# EAGLE design lt mikro workshop (EAGLE 7.6.0)
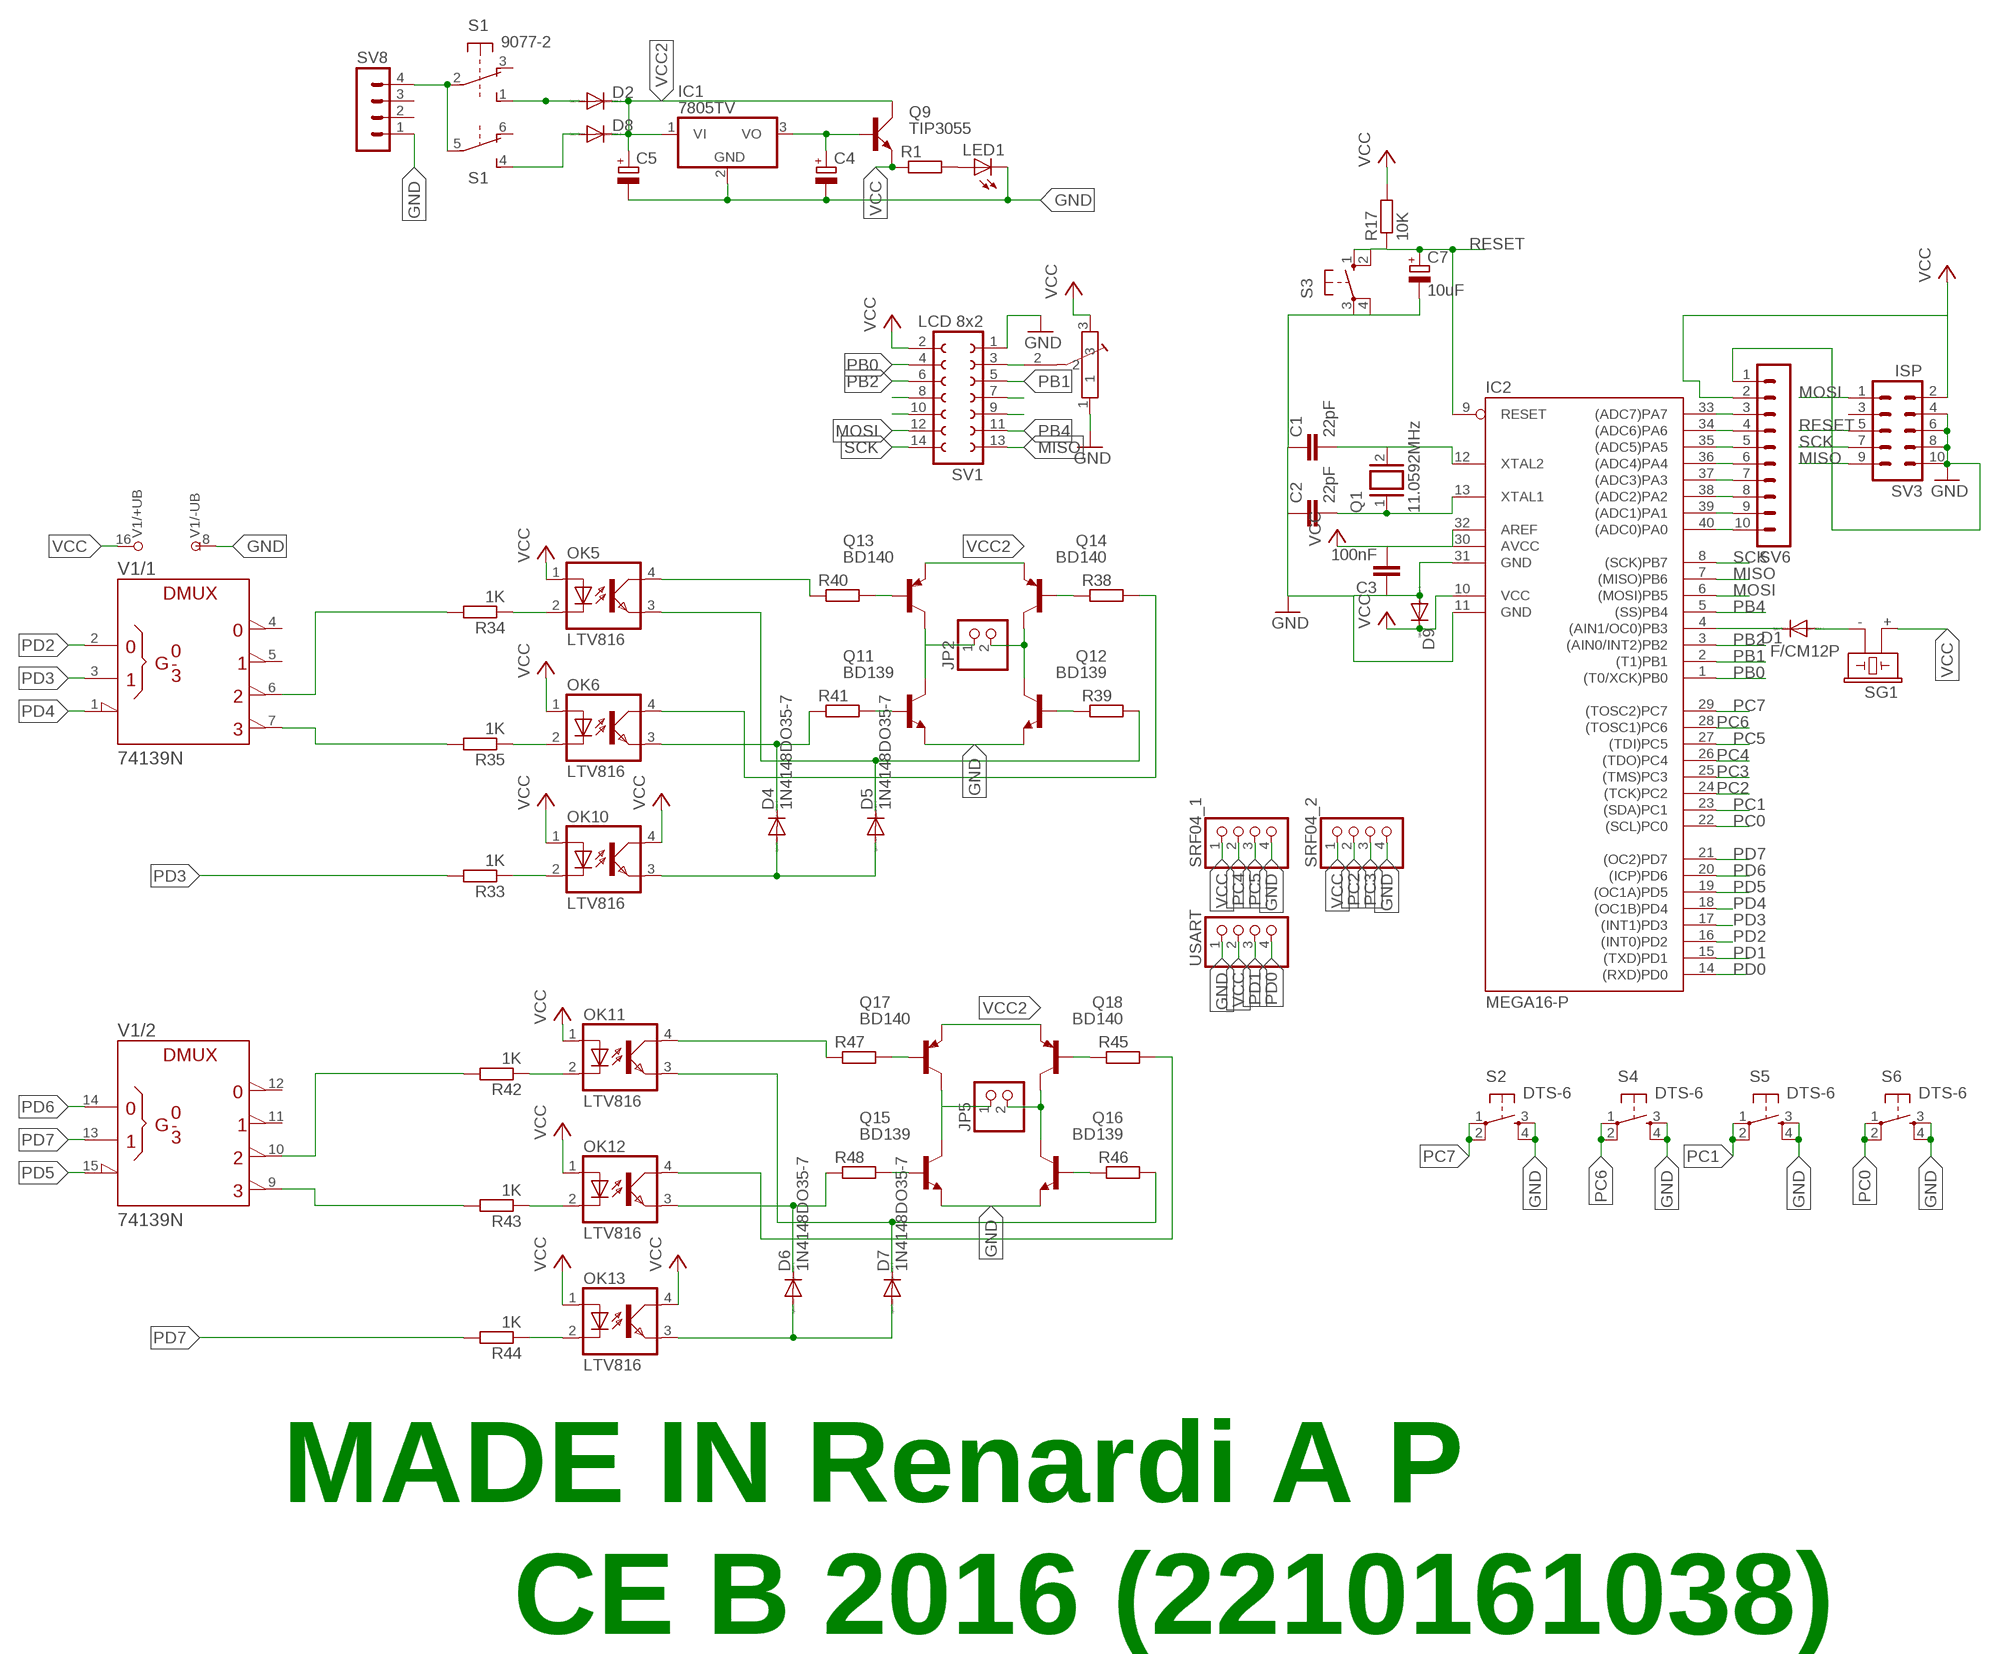
[diagram p0: schematic, sheet 1]

## Parts
C1  22pF  C2.5/2  [C2.5-2]
C2  22pF  C2.5/2  [C2.5-2]
C3  100nF  C2.5/2  [C2.5-2]
C4  CPOL-EUE3.5-10  [E3,5-10]
C5  CPOL-EUE3.5-10  [E3,5-10]
C7  10uF  CPOL-EUE2-5  [E2-5]
D1  DIODE-DO214AA  [DO214AA]
D2  DIODE-DO214AA  [DO214AA]
D4  1N4148DO35-7  [DO35-7]
D5  1N4148DO35-7  [DO35-7]
D6  1N4148DO35-7  [DO35-7]
D7  1N4148DO35-7  [DO35-7]
D8  DIODE-DO214AA  [DO214AA]
D9  DIODE-DO214AA  [DO214AA]
IC1  7805TV  [TO220V]
IC2  MEGA16-P  [DIL40]
JP2  PINHD-1X2  [1X02]
JP5  PINHD-1X2  [1X02]
LED1  LED3MM  [LED3MM]
OK5  LTV816  [DIL04]
OK6  LTV816  [DIL04]
OK10  LTV816  [DIL04]
OK11  LTV816  [DIL04]
OK12  LTV816  [DIL04]
OK13  LTV816  [DIL04]
Q1  11.0592MHz  XTAL/S  [QS]
Q9  TIP3055  [TOP3AV]
Q11  BD139  [TO126]
Q12  BD139  [TO126]
Q13  BD140  [TO126]
Q14  BD140  [TO126]
Q15  BD139  [TO126]
Q16  BD139  [TO126]
Q17  BD140  [TO126]
Q18  BD140  [TO126]
R1  R-EU_0207/7  [0207/7]
R17  10K  R-EU_0204/7  [0204/7]
R33  1K  R-EU_0204/7  [0204/7]
R34  1K  R-EU_0204/7  [0204/7]
R35  1K  R-EU_0204/7  [0204/7]
R38  R-EU_0207/7  [0207/7]
R39  R-EU_0207/7  [0207/7]
R40  R-EU_0207/7  [0207/7]
R41  R-EU_0207/7  [0207/7]
R42  1K  R-EU_0204/7  [0204/7]
R43  1K  R-EU_0204/7  [0204/7]
R44  1K  R-EU_0204/7  [0204/7]
R45  R-EU_0207/7  [0207/7]
R46  R-EU_0207/7  [0207/7]
R47  R-EU_0207/7  [0207/7]
R48  R-EU_0207/7  [0207/7]
S1  9077-2  [9077-2]
S2  DTS-6  [DTS-6]
S3  10-XX  [B3F-10XX]
S4  DTS-6  [DTS-6]
S5  DTS-6  [DTS-6]
S6  DTS-6  [DTS-6]
SG1  F/CM12P  [F/CM12P]
SRF04_1  PINHD-1X4  [1X04]
SRF04_2  PINHD-1X4  [1X04]
SV1  LCD 8x2  FE07-2  [FE07-2]
SV3  ISP  MA05-2  [MA05-2]
SV6  MA10-1  [MA10-1]
SV8  MA04-1  [MA04-1]
U$1  TRIMPOT  [TRIMPOT]
USART  PINHD-1X4  [1X04]
V1  74139N  [DIL16]

## Nets
GND: C1.1 C2.1 C3.1 C4.- C5.- C7.- D9.A IC1.2(GND) IC2.11(GND) IC2.31(GND) LED1.K(C) Q11.1(E) Q12.1(E) Q15.1(E) Q16.1(E) S2.3 S2.4 S3.3(P) S3.4(P1) S4.3 S4.4 S5.3 S5.4 S6.3 S6.4 SRF04_1.4 SRF04_2.4 SV1.1 SV3.4 SV3.6 SV3.8 SV3.10 SV6.1 SV8.1 U$1.1 USART.1 V1.8(/-UB:-UB)
MISO: IC2.7((MISO)PB6) SV1.13 SV3.9
MOSI: IC2.6((MOSI)PB5) SV1.12 SV3.1
N$2: LED1.A R1.2
N$3: D8.A S1.4(2:S)
N$4: D1.C IC2.4((AIN1/OC0)PB3)
N$5: SV1.8
N$6: SV1.10
N$7: SV1.7
N$9: C2.2 IC2.13(XTAL1) Q1.1
N$10: C1.2 IC2.12(XTAL2) Q1.2
N$11: D2.A S1.1(1:S)
N$14: OK10.2(C) R33.1
N$17: OK5.2(C) R34.1
N$18: OK6.2(C) R35.1
N$19: C4.+ IC1.3(VO) Q9.B
N$21: JP2.1 Q11.2(C) Q13.2(C)
N$22: S1.2(1:P) S1.5(2:P) SV8.4
N$23: SV1.9
N$24: JP2.2 Q12.2(C) Q14.2(C)
N$25: Q13.3(B) R40.2
N$26: Q14.3(B) R38.1
N$27: Q12.3(B) R39.1
N$48: R35.2 V1.7(/1:Y3)
N$49: R34.2 V1.6(/1:Y2)
N$50: Q11.3(B) R41.2
N$52: IC2.40((ADC0)PA0) SV6.10
N$53: IC2.33((ADC7)PA7) SV6.3
N$54: IC2.34((ADC6)PA6) SV6.4
N$55: IC2.35((ADC5)PA5) SV6.5
N$56: IC2.36((ADC4)PA4) SV6.6
N$57: IC2.37((ADC3)PA3) SV6.7
N$58: D1.A SG1.-
N$59: OK5.4(COL) R40.1
N$60: IC2.38((ADC2)PA2) SV6.8
N$61: IC2.39((ADC1)PA1) SV6.9
N$62: D5.C OK5.3(EMIT) R39.2
N$63: OK6.4(COL) R38.2
N$64: D4.C OK6.3(EMIT) R41.1
N$65: D4.A D5.A OK10.3(EMIT)
N$66: OK12.2(C) R43.1
N$67: OK11.2(C) R42.1
N$68: OK13.2(C) R44.1
N$70: R43.2 V1.9(/2:Y3)
N$71: R42.2 V1.10(/2:Y2)
N$72: JP5.1 Q15.2(C) Q17.2(C)
N$73: JP5.2 Q16.2(C) Q18.2(C)
N$74: Q17.3(B) R47.2
N$75: Q18.3(B) R45.1
N$76: Q16.3(B) R46.1
N$77: Q15.3(B) R48.2
N$78: OK11.4(COL) R47.1
N$79: D7.C OK11.3(EMIT) R46.2
N$80: OK12.4(COL) R45.2
N$81: D6.C OK12.3(EMIT) R48.1
N$82: D6.A D7.A OK13.3(EMIT)
PB0: IC2.1((T0/XCK)PB0) SV1.3 SV1.4 U$1.2
PB1: IC2.2((T1)PB1) SV1.5
PB2: IC2.3((AIN0/INT2)PB2) SV1.6
PB4: IC2.5((SS)PB4) SV1.11
PC0: IC2.22((SCL)PC0) S6.1 S6.2
PC1: IC2.23((SDA)PC1) S5.1 S5.2
PC2: IC2.24((TCK)PC2) SRF04_2.2
PC3: IC2.25((TMS)PC3) SRF04_2.3
PC4: IC2.26((TDO)PC4) SRF04_1.2
PC5: IC2.27((TDI)PC5) SRF04_1.3
PC6: IC2.28((TOSC1)PC6) S4.1 S4.2
PC7: IC2.29((TOSC2)PC7) S2.1 S2.2
PD0: IC2.14((RXD)PD0) USART.4
PD1: IC2.15((TXD)PD1) USART.3
PD2: IC2.16((INT0)PD2) V1.2(/1:A)
PD3: IC2.17((INT1)PD3) R33.2 V1.3(/1:B)
PD4: IC2.18((OC1B)PD4) V1.1(/1:!G)
PD5: IC2.19((OC1A)PD5) V1.15(/2:!G)
PD6: IC2.20((ICP)PD6) V1.14(/2:A)
PD7: IC2.21((OC2)PD7) R44.2 V1.13(/2:B)
RESET: C7.+ IC2.9(RESET) R17.1 S3.1(S) S3.2(S1) SV3.5
SCK: IC2.8((SCK)PB7) SV1.14 SV3.7
VCC: C3.2 D9.C IC2.10(VCC) IC2.30(AVCC) IC2.32(AREF) OK5.1(A) OK6.1(A) OK10.1(A) OK10.4(COL) OK11.1(A) OK12.1(A) OK13.1(A) OK13.4(COL) Q9.E R1.1 R17.2 SG1.+ SRF04_1.1 SRF04_2.1 SV1.2 SV3.2 SV6.2 U$1.3 USART.2 V1.16(/+UB:+UB)
VCC2: C5.+ D2.C D8.C IC1.1(VI) Q9.C Q13.1(E) Q14.1(E) Q17.1(E) Q18.1(E)
Unconnected: S1.3(1:O) S1.6(2:O) SV3.3 SV8.2 SV8.3 V1.4(/1:Y0) V1.5(/1:Y1) V1.11(/2:Y1) V1.12(/2:Y0)

## Notes on the sheet
- MADE IN Renardi A P
- CE B 2016 (2210161038)

## Library data of the parts
C1-C3 = capacitor-wima:C: CAPACITOR naming: grid - package width
C4 C5 C7 = rcl:CPOL-EU: POLARIZED CAPACITOR, European symbol
D1 D2 D8 D9 = diode:DIODE-: DIODE
D4-D7 = diode:1N4148: DIODE high speed (Philips)
IC1 = linear:78*: Positive VOLTAGE REGULATOR Source: http://cache.national.com/ds/LM/LM78L05.pdf http://www.fairchildsemi.com/ds/LM/LM7805.pdf
IC2 = atmel:MEGA16-P: MICROCONTROLLER 16 Kbytes FLASH 1 kbytes SRAM 512 bytes EEPROM USART 8-channel 10 bit ADC Source: avr.lbr
JP2 JP5 = pinhead:PINHD-1X2: PIN HEADER
LED1 = led:LED: LED OSRAM: - CHIPLED LG R971, LG N971, LY N971, LG Q971, LY Q971, LO R971, LY R971 LH N974, LH R974 LS Q976, LO Q976, LY Q976 LO Q996 - Hyper CHIPLED LW Q18S LB Q993, LB Q99A, LB R99A - SideLED LS A670, LO A670, LY A670, LG A670, LP A670 LB A673, LV A673, LT A673, LW A673 LH A674 LY A675 LS A676, LA A676, LO A676, LY A676, LW A676 LS A679, LY A679, LG A679 - Hyper Micro SIDELED® LS Y876, LA Y876, LO Y876, LY Y876 LT Y87S - SmartLED LW L88C, LW L88S LB L89C, LB L89S, LG L890 LS L89K, LO L89K, LY L89K LS L896, LA L896, LO L896, LY L896 - TOPLED LS T670, LO T670, LY T670, LG T670, LP T670 LSG T670, LSP T670, LSY T670, LOP T670, LYG T670 LG T671, LOG T671, LSG T671 LB T673, LV T673, LT T673, LW T673 LH T674 LS T676, LA T676, LO T676, LY T676, LB T676, LH T676, LSB T676, LW T676 LB T67C, LV T67C, LT T67C, LS T67K, LO T67K, LY T67K, LW E67C LS E67B, LA E67B, LO E67B, LY E67B, LB E67C, LV E67C, LT E67C LW T67C LS T679, LY T679, LG T679 LS T770, LO T770, LY T770, LG T770, LP T770 LB T773, LV T773, LT T773, LW T773 LH T774 LS E675, LA E675, LY E675, LS T675 LS T776, LA T776, LO T776, LY T776, LB T776 LHGB T686 LT T68C, LB T68C - Hyper Mini TOPLED® LB M676 - Mini TOPLED Santana® LG M470 LS M47K, LO M47K, LY M47K Source: http://www.osram.convergy.de LUXEON: - LUMILED® LXK2-PW12-R00, LXK2-PW12-S00, LXK2-PW14-U00, LXK2-PW14-V00 LXK2-PM12-R00, LXK2-PM12-S00, LXK2-PM14-U00 LXK2-PE12-Q00, LXK2-PE12-R00, LXK2-PE12-S00, LXK2-PE14-T00, LXK2-PE14-U00 LXK2-PB12-K00, LXK2-PB12-L00, LXK2-PB12-M00, LXK2-PB14-N00, LXK2-PB14-P00, LXK2-PB14-Q00 LXK2-PR12-L00, LXK2-PR12-M00, LXK2-PR14-Q00, LXK2-PR14-R00 LXK2-PD12-Q00, LXK2-PD12-R00, LXK2-PD12-S00 LXK2-PH12-R00, LXK2-PH12-S00 LXK2-PL12-P00, LXK2-PL12-Q00, LXK2-PL12-R00 Source: www.luxeon.com KINGBRIGHT: KA-3528ASYC Source: www.kingbright.com
OK5 OK6 OK10-OK13 = optocoupler:LTV816: OPTO COUPLER Source: LITEON, LTV816.pdf
Q1 = special:XTAL/S: CRYSTAL
Q9 = transistor-power:TIP3055: NPN TRANSISTOR
Q11 Q12 Q15 Q16 = transistor-npn:BD139*: NPN Transistor
Q13 Q14 Q17 Q18 = transistor-pnp:BD140: PNP Transistor
R1 R17 R33-R35 R38-R48 = resistor:R-EU_: RESISTOR, European symbol
S1 = switch-misc:9077-2: MARQUARDT SWITCH 9077.0200 Distributor: Buerklin <https://www.buerklin.com/default.asp?event=ShowArtikel%2812G2822%29&l=d&jump=ArtNr_12G2822>
S2 S4-S6 = switch-tact:DTS-6
S3 = switch-omron:10-XX: OMRON SWITCH
SG1 = buzzer:F/CM12P: BUZZER Source: Buerklin
SRF04_1 SRF04_2 USART = pinhead:PINHD-1X4: PIN HEADER
SV1 = con-lsta:FE07-2: FEMALE HEADER
SV3 = con-lstb:MA05-2: PIN HEADER
SV6 = con-lstb:MA10-1: PIN HEADER
SV8 = con-lstb:MA04-1: PIN HEADER; OC_FARNELL: unknown; OC_NEWARK: unknown
U$1 = trimpot:TRIMPOT
V1 = 74ttl-din:74*139: Dual 2-line to 4-line DECODER/DEMULTIPLEXER

## Board
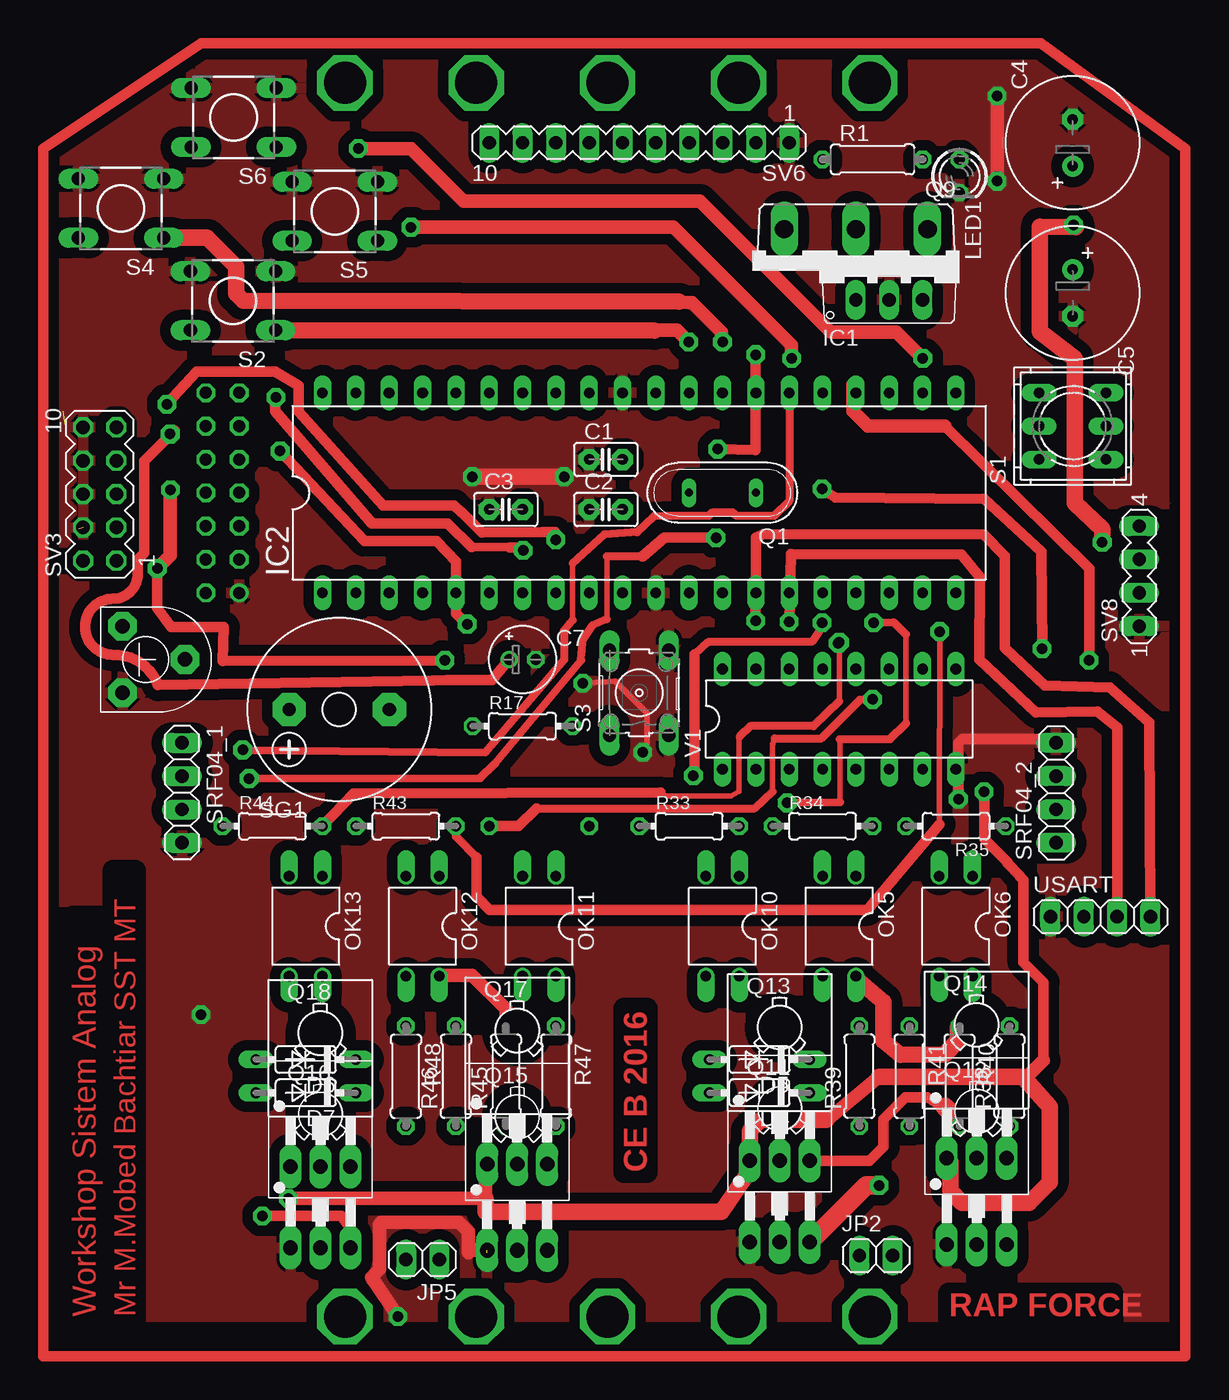
[diagram p1: board, top side]
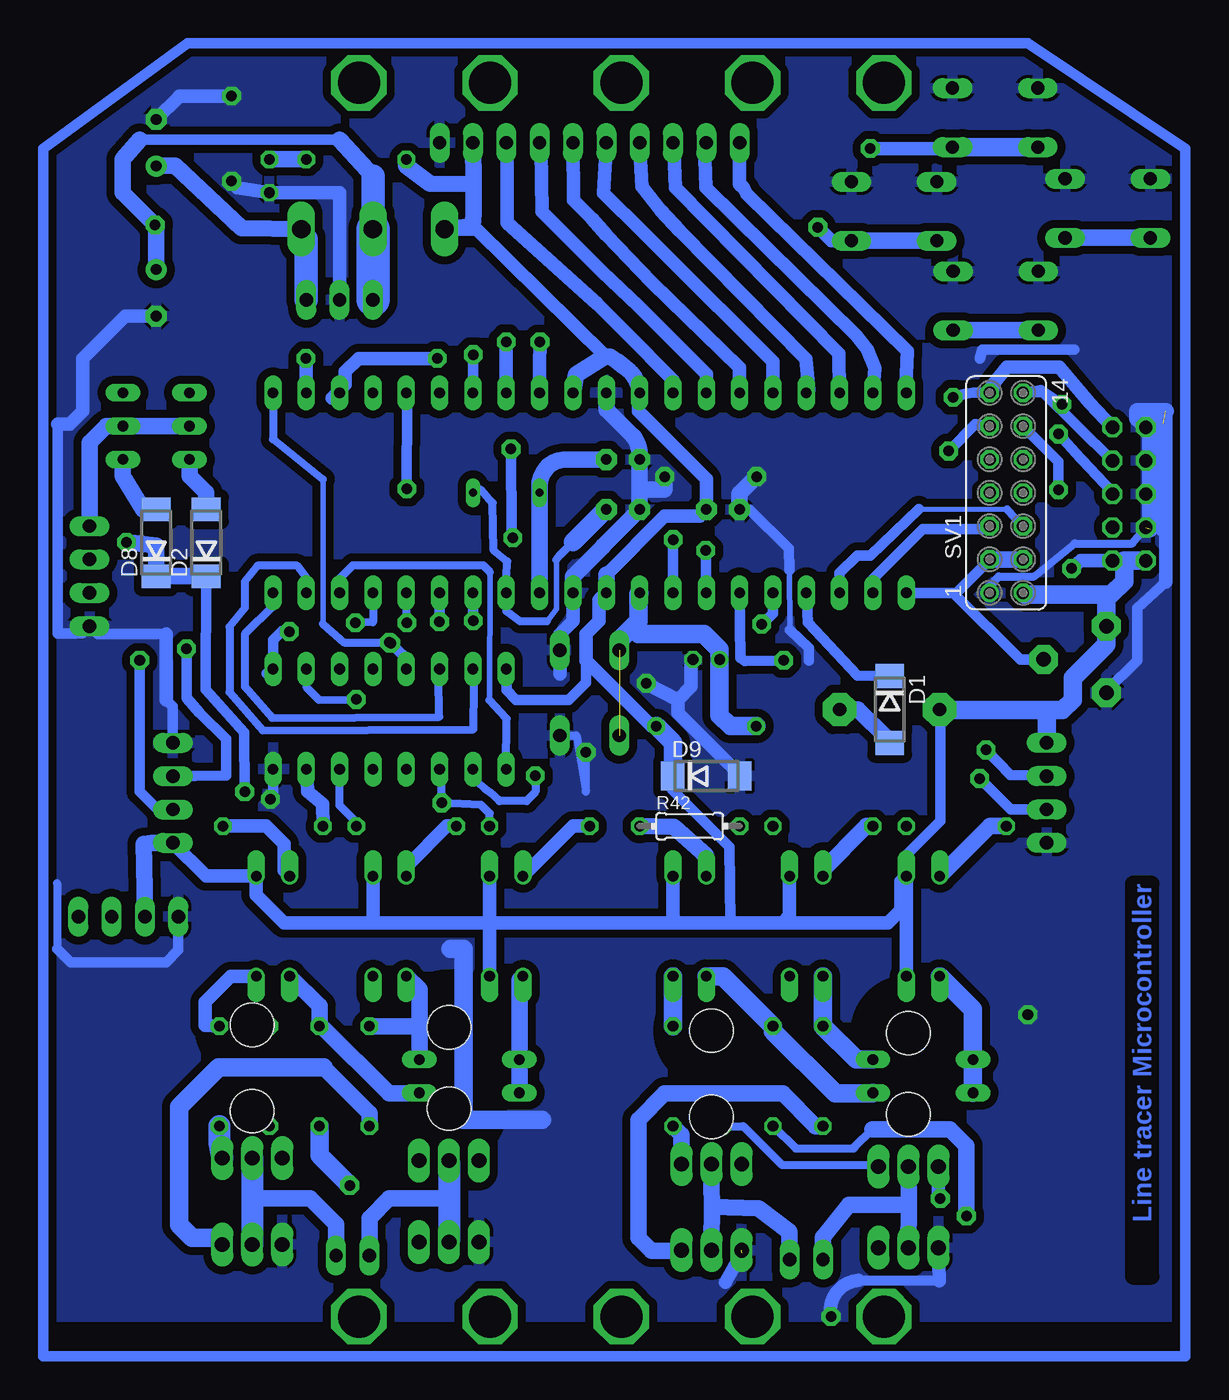
[diagram p2: board, bottom side, seen from below]

No outline drawn. Coordinates in mm, seen from the top.
Copper layers (1*16): Top 0.035mm / dielectric 1.5mm / Bottom 0.035mm
Design rules "default": minimum track width 10mil, minimum drill 24mil, track to track 8mil, track to pad 8mil, pad to pad 8mil, via to via 8mil, smd to smd 8mil, copper to edge 40mil, drill to drill 8mil, minimum pad ring 10mil, minimum via ring 8mil, stop-mask expansion 4mil, vias tented up to drill 0mil, thermal gap 10mil

### Footprints (pad centres in the part's own frame; a part is rotated, then mirrored left to right if it is on the bottom)
C2.5-2 = drill 0.813 pad 1.6 octagon: 1 -1.27,0; 2 1.27,0
E3,5-10 = drill 0.813 pad 1.6: + -1.778,0 | drill 0.813 pad 1.6 octagon: - 1.778,0
E2-5 = drill 0.813 pad 1.27: + -1.016,0 | drill 0.813 pad 1.27 octagon: - 1.016,0
DO214AA = smd 1.8 x 2.2: A 2.55,0; C -2.55,0
DO35-7 = drill 0.813 long: A 3.81,0; C -3.81,0
TO220V = drill 1.016 long: 1 -2.54,-2.54; 2 0,-2.54; 3 2.54,-2.54
DIL40 = drill 0.813 long: 1 -24.13,-7.62; 2 -21.59,-7.62; 3 -19.05,-7.62; 4 -16.51,-7.62; 5 -13.97,-7.62; 6 -11.43,-7.62; 7 -8.89,-7.62; 8 -6.35,-7.62; 9 -3.81,-7.62; 10 -1.27,-7.62; 11 1.27,-7.62; 12 3.81,-7.62; 13 6.35,-7.62; 14 8.89,-7.62; 15 11.43,-7.62; 16 13.97,-7.62; 17 16.51,-7.62; 18 19.05,-7.62; 19 21.59,-7.62; 20 24.13,-7.62; 21 24.13,7.62; 22 21.59,7.62; 23 19.05,7.62; 24 16.51,7.62; 25 13.97,7.62; 26 11.43,7.62; 27 8.89,7.62; 28 6.35,7.62; 29 3.81,7.62; 30 1.27,7.62; 31 -1.27,7.62; 32 -3.81,7.62; 33 -6.35,7.62; 34 -8.89,7.62; 35 -11.43,7.62; 36 -13.97,7.62; 37 -16.51,7.62; 38 -19.05,7.62; 39 -21.59,7.62; 40 -24.13,7.62
1X02 = drill 1.016 long: 1 -1.27,0; 2 1.27,0
LED3MM = drill 0.813 octagon: A -1.27,0; K 1.27,0
DIL04 = drill 0.813 offset: 1 -1.27,-3.81; 2 1.27,-3.81; 3 1.27,3.81; 4 -1.27,3.81
QS = drill 0.61 long: 1 -2.54,0; 2 2.54,0
TOP3AV = drill 1.397 long: B -5.461,-3.175; C 0,-3.175; E 5.461,-3.175
TO126 = drill 1.118 long: 1 -2.286,-5.08; 2 0,-5.08; 3 2.286,-5.08 | hole 3.302: 0,5.08
0207/7 = drill 0.813 octagon: 1 -3.81,0; 2 3.81,0
0204/7 = drill 0.813 octagon: 1 -3.81,0; 2 3.81,0
9077-2 = drill 0.813 long: 1 -2.54,2.54; 2 0,2.54; 3 2.54,2.54; 4 -2.54,-2.54; 5 0,-2.54; 6 2.54,-2.54
DTS-6 = drill 1 long: 1 -3.25,2.25; 2 3.25,2.25; 3 -3.25,-2.25; 4 3.25,-2.25
B3F-10XX = drill 1.016 long: 1 -3.251,2.261; 2 3.251,2.261; 3 -3.251,-2.261; 4 3.251,-2.261
F/CM12P = drill 1.016 pad 2.54 octagon: + 3.81,0; - -3.81,0
1X04 = drill 1.016 long: 1 -3.81,0; 2 -1.27,0; 3 1.27,0; 4 3.81,0
FE07-2 = drill 0.914: 1 -7.62,1.27 | drill 0.914 octagon: 2 -7.62,-1.27; 3 -5.08,1.27; 4 -5.08,-1.27; 5 -2.54,1.27; 6 -2.54,-1.27; 7 0,1.27; 8 0,-1.27; 9 2.54,1.27; 10 2.54,-1.27; 11 5.08,1.27; 12 5.08,-1.27; 13 7.62,1.27; 14 7.62,-1.27
MA05-2 = drill 1.016 octagon: 1 -5.08,-1.27; 2 -5.08,1.27; 3 -2.54,-1.27; 4 -2.54,1.27; 5 0,-1.27; 6 0,1.27; 7 2.54,-1.27; 8 2.54,1.27; 9 5.08,-1.27; 10 5.08,1.27
MA10-1 = drill 1.016 long: 1 -11.43,0; 2 -8.89,0; 3 -6.35,0; 4 -3.81,0; 5 -1.27,0; 6 1.27,0; 7 3.81,0; 8 6.35,0; 9 8.89,0; 10 11.43,0
MA04-1 = drill 1.016 long: 1 -3.81,0; 2 -1.27,0; 3 1.27,0; 4 3.81,0
TRIMPOT = drill 1.1 pad 2.184 octagon: 1 -2.538,1.271; 2 0,-3.5; 3 2.536,1.271
DIL16 = drill 0.813 long: 1 -8.89,-3.81; 2 -6.35,-3.81; 3 -3.81,-3.81; 4 -1.27,-3.81; 5 1.27,-3.81; 6 3.81,-3.81; 7 6.35,-3.81; 8 8.89,-3.81; 9 8.89,3.81; 10 6.35,3.81; 11 3.81,3.81; 12 1.27,3.81; 13 -1.27,3.81; 14 -3.81,3.81; 15 -6.35,3.81; 16 -8.89,3.81

### Placement (x,y rotation side)
C1  42.85,67.31 0 top
C2  42.85,63.5 0 top
C3  35.23,63.5 0 top
C4  78.41,91.44 90 top
C5  78.41,80.01 270 top
C7  36.5,52.07 0 top
D1  22.53,48.26 270 bottom
D2  74.6,60.96 90 bottom
D4  54.55,19.05 180 top
D5  54.55,21.59 180 top
D6  19.99,21.59 180 top
D7  19.99,19.05 180 top
D8  78.41,60.96 90 bottom
D9  36.5,43.18 0 bottom
IC1  64.44,82.01 0 top
IC2  45.39,64.77 0 top
JP2  63.44,6.65 0 top
JP5  28.88,6.35 180 top
LED1  69.79,88.9 270 top
OK5  60.63,31.75 180 top
OK6  69.52,31.75 180 top
OK10  51.74,31.75 180 top
OK11  37.77,31.75 180 top
OK12  28.88,31.75 180 top
OK13  19.99,31.75 180 top
Q1  51.74,64.77 180 top
Q9  61.9,81.68 180 top
Q11  56.1,12.77 0 top
Q12  71.1,12.58 0 top
Q13  56.1,18.96 0 top
Q14  71.1,19.15 0 top
Q15  36.1,12.14 0 top
Q16  21.1,12.33 0 top
Q17  36.1,18.71 0 top
Q18  21.1,18.52 0 top
R1  63.17,90.17 0 top
R17  36.5,46.99 0 top
R33  49.2,39.37 0 top
R34  59.36,39.37 0 top
R35  69.52,39.37 180 top
R38  73.6,20.32 90 top
R39  62.17,20.32 90 top
R40  69.79,20.32 270 top
R41  65.98,20.32 270 top
R42  37.77,39.37 0 bottom
R43  27.61,39.37 0 top
R44  17.45,39.37 0 top
R45  35.23,20.32 90 top
R46  31.42,20.32 90 top
R47  39.04,20.32 270 top
R48  27.61,20.32 270 top
S1  78.41,69.85 90 top
S2  14.45,79.4 180 top
S3  45.39,49.53 90 top
S4  5.91,86.44 180 top
S5  22.19,86.22 180 top
S6  14.49,93.36 180 top
SG1  22.53,48.26 180 top
SRF04_1  10.56,41.91 270 top
SRF04_2  77.14,41.91 90 top
SV1  13.64,64.77 90 bottom
SV3  4.29,64.67 90 top
SV6  45.39,91.44 180 top
SV8  83.49,58.42 90 top
U$1  7.29,52.07 90 top
USART  80.54,32.47 0 top
V1  60.63,47.53 0 top

### Tracks (layer width: path | path; a pad name or v marks a point on that pad's centre or on a via)
GND  (via drill 0.8 pad 1.42)  (4 unrouted)
  Top 0.406: v41.08,50.25 43.56,50.44 46,48 46,45
  Top 0.813: v69.71,41.42 69.71,45.71 70,46 76.86,46 SRF04_2.4
  Top 1.016: v72.67,88.51 v72.67,95 | v27,2 25,5 25.59,5.59 25.59,9.03 25.74,9.18 31.68,9.18 32.4,8.46 32.4,6.88 32.58,7.06 Q15.1
  Top 1.27: v32.67,66 v39.67,66
  Bottom 0.406: 30.14,54.31 30.16,58.89
  Bottom 0.61: SV1.1 14.91,57.67 14.22,58.39 11.51,58.39 8.42,60.91 4.04,60.91 SV3.4 | 85.96,35.03 85.96,30.03 | S3.3 46.39,46.28 45.67,42 v45.67,45
  Bottom 0.813: U$1.1 6.02,49.65 3.67,52 3.67,56 1.47,57.96 | 8.47,75.69 15.47,75.69 15.67,75 | 28.67,52 28.67,52.93 30.14,54.31 | 30.16,58.89 30.21,60.52 33.2,63.5 C3.1 | SRF04_2.4 77.14,48.47 77.67,49 | 77.67,54 82.88,54 SV8.1 84.05,54.05 85.9,54.05 85.9,64 | USART.1 76.72,29.94 77.67,29 84.94,29 85.96,30.03 | 85.9,63.99 85.9,70 | V1.8 69.52,41.61 v69.71,41.42 | 18.74,4.74 24.9,4.75
  Bottom 1.016: IC1.2 64.44,87.63 LED1.K 72.25,88 v72.67,88.51 | IC2.11 46.67,55 47.65,54.02 S3.4 47.65,50.98 | v41.08,50.25 38.67,49 | 38.67,49 37.67,50 37.67,51.91 C7.- | D9.A 33.95,43.28 38.67,48 38.67,49 | v72.67,95 76.67,95 76.67,94.96 C4.- | 1.47,57.96 1.49,70.98 | 77.67,49 77.67,54 | 85.9,70 85,70 84,71 84,75 80.77,78.23 C5.- | 35.03,4.6 33.78,6.87 | Q16.1 18.74,4.74 | 24.9,4.75 arc-98 v27,2
  Bottom 1.27: 41.58,65 C1.1 41.58,67.75 arc-45 42.16,69.16 44.12,71.12 IC2.31 | 41.58,65 C2.1 44.37,60.71 44.37,60.68 46.66,58.39 IC2.11 | C3.1 33.96,64.71 v32.67,66 | v39.67,66 39.67,65 41.58,65 | 1.49,70.98 3.67,71 3.67,70.41 SV3.10 | 2.67,70 2.67,62 | 1.67,70 1.67,62
  Bottom 1.422: 56,30 55,30 55,17 49,17
  other vias: 12,25
  pour Bottom (isolate 0.61): 12,98 76,98 86,91 86,2 1,2 1,91
  pour Top (isolate 0.813): 12,98 76,98 86,91 86,2 1,2 1,91
MISO  (via drill 0.8 pad 1.42)
  Top 0.7: 35.55,60.61 32.63,60.62
  Top 0.813: v36.55,60.38 36.36,60.59 35.55,60.61 | 32.63,60.62 30.79,62.43 25.05,62.43 17.67,71 v17.7,72.04
  Bottom 0.813: IC2.7 36.54,59.34 v36.55,60.38 | v17.7,72.04 16.68,72.34 16.1,72.42 14.94,72.42 SV1.13
  Bottom 1.016: SV3.9 7.29,71.62 9.59,74.35 13.59,74.35 14.67,73 14.67,72.63 SV1.13
MOSI  (via drill 0.8 pad 1.42)
  Top 0.813: v8.67,59 8.67,56 9.75,54.53 13.74,54.53 13.67,51.94 v30.59,52
  Top 1.016: v8.67,59 9.67,60 v9.67,65
  Bottom 0.813: v9.67,65 9.67,67.15 SV1.12 | IC2.6 33.88,52.18 33.56,51.94 v30.59,52
  Bottom 1.016: SV3.1 7.95,59.6 v8.67,59
N$2
  Bottom 1.27: R1.2 LED1.A
N$3
  Bottom 1.27: D8.A 79.42,63.51 80.95,66.04 S1.4
N$4
  Bottom 0.813: D1.C 24.98,50.84 28.77,54.88 28.86,57.13 IC2.4
N$8  (via drill 3.2)
  other vias: 52.97,96
N$9
  Bottom 0.406: 47.92,59.68 47.92,55.9 48.63,54.97
  Bottom 0.61: 46.67,61 47.67,60 47.92,59.68 | 48.63,54.97 50.66,54.97 51.72,55.74 51.74,56.5 IC2.13 51.67,59.55 52.71,60.38 52.77,64 53.67,65 54.05,65 Q1.1
  Bottom 1.422: C2.2 44.17,63.5 46.67,61
N$10
  Bottom 1.27: IC2.12 Q1.2 49.2,65.31 arc90 47.2,67.31 C1.2
N$11
  Bottom 1.27: D2.A 74.6,64.77 75.87,66.04 S1.1
N$12  (via drill 3.2)
  other vias: 22.97,96
N$13  (via drill 3.2)
  other vias: 42.97,96
N$14
  Bottom 1.016: R33.1 46.66,39.37 OK10.2
N$15  (via drill 3.2)
  other vias: 32.97,96
N$16  (via drill 3.2)
  other vias: 62.97,96
N$17
  Bottom 1.016: R34.1 56.3,39.37 59.2,36.47 59.31,36.12 OK5.2
N$18
  Bottom 1.016: R35.1 70.04,39.37 68.67,38 68.67,35.98 OK6.2
N$19
  Bottom 1.27: 66.98,84.07 Q9.B 71.9,84.93 76.95,89.68 78.06,89.71 C4.+
  Bottom 1.778: IC1.3 66.98,84.07
N$20  (via drill 3.2)
  other vias: 32.97,2
N$21
  Bottom 1.27: JP2.1 62.17,9.5 60.67,11 56.1,11
  Bottom 1.676: Q13.2 56.1,11 Q11.2
N$22
  Bottom 1.27: SV8.4 83.49,68.58 82.22,69.85 S1.5 S1.2
N$24
  Bottom 1.27: JP2.2 64.71,9.04 66.67,11 71.1,11
  Bottom 1.676: Q14.2 71.1,11 Q12.2
N$25
  Top 0.813: 68.67,18 68.44,18 67.34,18.7 66.32,18.7 65.89,18.7 65.66,18.7 64,17.04 64,14.93 62.93,13.86 58.41,13.86 Q13.3
  Top 1.422: R40.2 69.79,16.88 68.67,18
N$26
  Bottom 1.676: R38.1 73.6,15.28 Q14.3
N$27
  Bottom 1.27: R39.1 62.17,17.5 65.67,21
  Bottom 1.422: 65.67,21 73.67,21 76.67,18 76.67,9 75.67,8 73.89,8 Q12.3
N$28  (via drill 3.2)
  other vias: 22.97,2
N$29  (via drill 3.2)
  other vias: 42.97,2
N$30  (via drill 3.2)
  other vias: 52.97,2
N$31  (via drill 3.2)
  other vias: 62.97,2
N$32
  Bottom 0.813: 12,99 76,99 87,91 87,-1 0,-1 0,91 12,99
N$33
  Top 0.813: 0,91 12,99 76,99 87,91 87,-1 0,-1 0,91
N$48
  Bottom 1.016: R35.2 65.74,41.05 66.89,42.03 66.94,43.69 V1.7
N$49
  Bottom 0.61: R34.2 63.17,39.68 64.44,40.95 V1.6
N$50  (via drill 0.8 pad 1.42)
  Top 1.422: v63.67,12 62.7,12 Q11.3
  Bottom 1.422: R41.2 65.98,14.31 v63.67,12
N$52
  Bottom 1.016: SV6.10 33.96,88.29 33.67,88 33.39,87.51 21.17,75.56 21.29,72.89 IC2.40
N$53
  Bottom 1.016: IC2.33 39.04,73.37 42.67,77 44.79,79.16 51.67,85.36 51.67,91.37 SV6.3
N$54
  Bottom 1.016: IC2.34 36.5,73.83 41.67,79 44.43,81.63 49.03,86.17 49.07,90.91 SV6.4
N$55
  Bottom 1.016: IC2.35 33.96,74.29 40.69,80.83 44.1,84.41 45.26,85.7 46.62,87.07 SV6.5
N$56
  Bottom 1.016: IC2.36 31.42,74.75 39.67,83 41.33,84.61 44.31,87.61 SV6.6
N$57
  Bottom 1.016: SV6.7 41.41,88.1 40.01,86.29 38.52,84.7 28.89,74.96 28.67,72.6 IC2.37
N$58
  Bottom 1.27: SG1.- 24.93,48.26 22.67,46 22.67,45.85 D1.A
N$59
  Top 1.27: OK5.4 61.9,27.77 63.99,26 63.99,23 65.27,21.96 68.67,22 69.67,23 69.67,24.01 R40.1
N$60
  Bottom 1.016: IC2.38 26.4,75.39 38.85,88.01 38.97,90.72 SV6.8
N$61
  Bottom 1.016: IC2.39 23.66,74.25 24.23,75.68 25.07,76.73 36.52,88.02 36.62,91.27 SV6.9
N$62
  Bottom 1.27: D5.C 58.36,24 | 58.36,24 58.36,26.94 OK5.3 | R39.2 58.49,24.13 58.36,24
N$63
  Bottom 1.016: OK6.4 72.73,27.94 74.67,26 74.67,24.2 R38.2
N$64
  Bottom 1.27: 58.31,19 60.67,19 65.8,24.13 R41.1 65.98,25.67 OK6.3 | 57.67,19 58.31,19 | 58.31,19 D4.C
N$65
  Bottom 1.27: D4.A D5.A 50.74,27.67 OK10.3
N$66
  Bottom 1.27: R43.1 24.3,39.37 27.67,36 27.67,35.62 OK12.2
N$67
  Bottom 1.27: R42.1 38.98,39.3 36.52,37.15 36.44,35.69 OK11.2
N$68
  Bottom 1.27: R44.1 14.91,39.37 OK13.2
N$70  (via drill 0.8 pad 1.42)
  Top 0.406: 68.27,39.51 68.29,54.18
  Top 0.61: R43.2 31.42,38.58 33,37
  Top 0.813: 33,37 33,34 34,33 62.78,33 68.27,39.51 | 68.29,54.18 v68.27,54.19
  Bottom 0.813: v68.27,54.19 68.82,54.23 69.5,53.56 69.5,51.5 70,51 69.86,51 V1.9
N$71  (via drill 0.8 pad 1.42)
  Top 0.406: 55.56,42.01 55.56,45.63 55.57,45.65 55.6,45.84 55.72,46.06
  Top 0.61: 37.55,40.73 54.18,40.73 55.56,42.01 | 55.72,46.06 59.26,46.06 62.2,49 v63.17,49.02
  Top 0.813: R42.2 36.19,39.37 37.55,40.73
  Bottom 0.61: v63.17,49.02 66,49 66.98,49.98 V1.10
N$72
  Bottom 1.27: JP5.1 30.15,8.48 32.51,10.26 36.07,10.35 | 36.07,10.35 36.09,12.1 Q17.2 | 36.07,10.35 36.09,7.62 Q15.2
N$73
  Bottom 1.27: Q18.2 21.08,10.53 | 21.08,10.53 Q16.2 | JP5.2 27.61,8.06 25.65,10.53 21.08,10.53
N$74
  Bottom 1.27: Q17.3 38.38,15.86 R47.2
N$75
  Bottom 0.61: R45.1 33.68,16.51 30.72,13.55 23.5,13.55 Q18.3
N$76  (via drill 0.8 pad 1.42)
  Top 0.813: v16.68,9.66 22.68,9.66 23.4,8.72 23.4,7.25
  Top 1.27: 23.4,7.25 Q16.3
  Bottom 0.61: R46.1 31.38,16.51 29.68,14.82 25.28,14.82 25.21,14.88 25.21,14.93 23.86,16.28
  Bottom 1.27: 23.86,16.28 17.95,16.28 16.67,15 16.67,11.19 v16.68,9.66
N$77
  Bottom 1.27: R48.2 28.18,16.51 30.67,19 39.67,19 41.67,17 41.67,8 40.67,7 38.45,7 Q15.3
N$78
  Bottom 1.422: OK11.4 R47.1
N$79
  Bottom 1.422: OK11.3 35.23,27.94 R46.2 31.42,23.75 26.67,19 23.85,19 D7.C
N$80
  Top 1.016: R45.2 35.23,25.44 32.67,28 30.21,28 OK12.4
N$81
  Bottom 1.422: OK12.3 R48.1 25.07,21.59 D6.C
N$82
  Bottom 1.422: OK13.3 16.18,25.4 D6.A D7.A
PB0
  Bottom 0.813: IC2.1 17.67,57.15 | 17.67,57.15 17.45,57.15 SV1.3 | U$1.2 12.59,52.07 17.67,57.15
  Bottom 1.27: SV1.3 SV1.4
PB1
  Bottom 0.813: IC2.2 23.8,58.2 20,62 15.14,62 SV1.5
PB2
  Bottom 0.406: 20.32,63.53 13.59,63.5
  Bottom 0.61: 13.59,63.5 12.98,62.85 SV1.6
  Bottom 0.813: IC2.3 26.34,58.66 25,60 24,60 20.32,63.53
PB4  (via drill 0.8 pad 1.42)
  Top 0.813: v32.27,54.76 31.42,55.56 31.42,59.54 29.93,61.08 24.48,61.1 v18.03,67.95
  Bottom 0.813: IC2.5 31.42,55.58 v32.27,54.76 | v18.03,67.95 16,70 SV1.11
PC0  (via drill 0.8 pad 1.42)
  Top 1.016: v67,75 65,77 60,77 50,87 32,87 28,91 v24,91
  Bottom 1.016: IC2.22 66.98,74.98 v67,75 | v24,91 17.85,91 S6.1
  Bottom 1.422: S6.2 S6.1
PC1  (via drill 0.8 pad 1.42)
  Top 1.016: v28,85 48,85 57,76 v57,75
  Bottom 1.016: S5.1 26.97,83.97 v28,85 | v57,75 63,75 64,74 64,73 65,72 64.83,72 IC2.23
  Bottom 1.27: S5.2 S5.1
PC2  (via drill 0.8 pad 1.42)
  Top 0.813: v79.67,52 79.67,59 68.67,69.84
  Top 1.016: 68.67,69.84 62.83,69.84 61.67,71 61.67,72.62 | 61.67,73 61.67,72.62 | 61.67,72.62 IC2.24
  Bottom 0.813: SRF04_2.2 78.31,40.64 79.67,42 v79.67,52
PC3  (via drill 0.8 pad 1.42)
  Top 0.813: v76.1,52.89 76.03,60.29 71.67,64.3 60.36,64.41 v59.32,65.06
  Bottom 0.813: SRF04_2.3 75.49,43.18 73.1,43.23 73.1,46.01 75.1,48.01 76.1,49.12 v76.1,52.89 | v59.32,65.06 59.28,71.73 IC2.25
PC4  (via drill 0.8 pad 1.42)
  Top 0.406: 40.32,59.39 40.31,55.06
  Top 0.61: v15.18,45.18 33.67,45 39.69,52.05 39.7,54.2 39.64,54.26 40.1,54.84 40.31,55.06 | IC2.26 56.82,64.15 55.67,63 52.81,63 52.56,63.25 50.92,63.25 50.67,63 47.67,63 47.45,62.97 | 40.32,59.39 42.74,61.59 45.25,61.77 46.51,62.96 47.32,63 47.45,62.97 | 47.52,63 47.45,62.97
  Bottom 0.813: SRF04_1.2 13.31,43.27 v15.18,45.18
PC5  (via drill 0.8 pad 1.42)
  Top 0.406: 42.93,59.92 42.92,55.14
  Top 0.61: v15.67,43 33.28,43.03 34.41,44.13 40.96,52 40.98,52.59 41.03,53.5 41.8,54.65 42.92,55.14 | 45.62,59.9 42.93,59.92
  Top 0.813: v54.26,75.29 54.26,68.03 v51.38,68.1 | v51.24,61.34 47.33,61.34 45.62,59.9
  Bottom 0.813: SRF04_1.3 13.31,40.64 v15.67,43 | IC2.27 54.28,75.27 v54.26,75.29 | v51.38,68.1 51.34,61.79 v51.24,61.34
PC6  (via drill 0.8 pad 1.42)
  Top 1.016: 48.43,79.31 49.17,79.27 49.4,79.27 51.67,77 51.67,76.34 v51.73,76.28
  Top 1.27: S4.1 12.48,84.19 14.67,82 14.67,79.93 15.2,79.41 48.43,79.31
  Bottom 1.016: IC2.28 51.74,75.93 51.73,75.98 v51.73,76.28
  Bottom 1.27: S4.1 S4.2
PC7  (via drill 0.8 pad 1.42)
  Top 1.016: 46.55,77.1 46.52,77.15 48.28,77.15 v49.17,76.26
  Top 1.27: S2.1 46.55,77.1
  Bottom 1.016: IC2.29 49.2,74.47 v49.17,76.26
  Bottom 1.27: S2.2 S2.1
PD0  (via drill 0.8 pad 1.42)
  Top 0.813: v54.26,55.03 54.29,61.36 54.86,61.62 71.64,61.58 73.23,59.93 73.23,52.93 76.3,50.1 81.24,49.95 84.27,47.27 USART.4
  Bottom 0.813: IC2.14 v54.26,55.03
PD1  (via drill 0.8 pad 1.42)
  Top 0.813: v56.83,54.93 56.94,60.1 69.92,60.08 71.33,58.35 71.31,52.08 75.61,48.04 80.29,48.11 81.81,46.87 81.82,43.31 USART.3
  Bottom 0.813: IC2.15 v56.83,54.93
PD2  (via drill 0.8 pad 1.42)
  Top 0.61: v59.32,54.87 59.32,54.55 58.55,53.41 50.65,53.38 49.6,52.46
  Top 0.813: 49.6,52.46 49.6,43.28 v49.52,43.2
  Bottom 0.61: IC2.16 59.36,54.91 v59.32,54.87 | v49.52,43.2 49.53,41.99 50.18,41.28 52.26,41.28 53.01,41.97 53.32,42.19 54.24,42.97 54.26,42.98 V1.2
PD3  (via drill 0.8 pad 1.42)
  Top 0.406: 60.67,46 60.7,41.18 | 65.71,47.2 65.71,53.98
  Top 0.61: v63.25,54.86 64.76,54.91 65.34,54.36 | 65.34,54.36 65.71,54 | 60.7,41.18 v56.66,41.14 | 60.67,46 64.5,46 65.71,47.2 | 65.71,53.98 65.34,54.36
  Bottom 0.61: IC2.17 61.9,54.92 v63.25,54.86 | V1.3 56.67,43.57 v56.66,41.14 53.67,41 53.01,40.34 R33.2
PD4
  Bottom 0.406: 53.02,48.97 52.99,58.71
  Bottom 0.61: V1.1 51.71,47.57 53.02,48.97 | 52.99,58.71 53.47,59.23 63.44,59.23 64.67,58 64.67,57.38 IC2.18
PD5
  Bottom 0.61: IC2.19 66.98,58.31 67.69,59.22 70.69,59.22 71.67,58 71.67,56 72.83,54.57 72.83,49.57 70.32,46.67 54.24,46.75 54.2,49.96 54.2,51.21 V1.15
PD6
  Bottom 0.61: IC2.20 69.52,56.15 71.67,54 71.67,50 69.59,47.62 56.85,47.7 56.9,50.88 56.9,51.37 V1.14
PD7  (via drill 0.8 pad 1.42)
  Top 0.406: v60.64,53.36 60.64,48.9 | 53.04,46.19 53,46.19 53,42 52.98,42 52.39,41.69 47.52,41.69 47.01,41.93
  Top 0.61: 60.67,53.19 v60.55,53.31 | 60.64,48.9 58.67,47 53.85,47 53.04,46.19
  Top 0.813: R44.2 23.64,41.87 47.01,41.93
  Bottom 0.406: 65.7,65.79 65.71,54.77
  Bottom 0.61: IC2.21 69.52,68.85 65.7,65.79 | 65.71,54.77 64.1,53.37 60.6,53.37 v60.55,53.31 60.67,53.2 59.82,52.69 59.82,52.66 59.27,52.12 59.27,51.42 V1.13
  Bottom 0.813: 59.27,51.42 59.28,52.2 59.41,52.2 v60.64,53.36
RESET  (via drill 0.8 pad 1.42)  (1 unrouted)
  Top 0.813: v9.65,69.24 9.99,69.49 7.69,67.17 7.67,60.17 7.47,59.98 | 7.47,59.98 | 7.47,59.98 7.18,59.68 7.18,58.57 arc-90 5.31,56.7 arc180 5.31,52.42 arc-71 8.71,50.12 29.67,50.48 30.76,50.5 34.17,50.5 C7.+
  Bottom 0.813: SV3.5 5.55,64.81 7.87,67.3 7.99,67.41 v9.65,69.24
  Bottom 1.422: R17.1 34.67,47 35.48,47.81 C7.+ 35.48,52.81 36.67,54 41.67,54 42.17,54.5 | S3.2 43.13,53.54 42.17,54.5 | 42.17,54.5 41.67,55 41.67,57.06 IC2.9
SCK  (via drill 0.8 pad 1.42)
  Top 0.813: v39.03,61.2 38.98,61.76 38.02,61.77 33.42,61.74 31.87,63.29 31.82,63.29 31.3,63.8 25.87,63.8 19.43,70.94 19.43,72.94 17.67,74 11.67,74 v9.4,71.51
  Bottom 0.813: IC2.8 39.04,59.46 v39.03,61.2 | v9.4,71.51 11.02,72.58 SV1.14 10.84,72.44 SV3.7
VCC
  Bottom 0.813: OK13.1 21.26,37.17 18.67,39.76 18.67,48.21 SG1.+ | D9.C 39.1,42.16 34.72,37.78 34.67,32 | 45.67,52 45.67,50.33 47,49 50.98,49 51.71,49.72 51.71,51.3 V1.16
  Bottom 1.016: Q9.E 54.01,84.86 44.19,75.17 | SRF04_2.1 74.6,35.56 OK6.1 70.79,34.12 68.67,32 61.67,32 | 61.67,32 52.67,32 | 52.67,32 38.67,32 | 38.67,32 34.67,32 30.67,32 | 30.67,32 22.67,32 21.67,33 21.67,35.15 OK13.1 OK13.4 | OK5.1 61.9,32.23 61.67,32 | OK10.1 53.01,32.34 52.67,32 | OK10.4 53.01,31.66 52.67,32 | OK11.1 39.04,32.37 38.67,32 | OK12.1 30.15,32.52 30.67,32 | R17.2 40.66,46.99 45.67,52 45.67,54 44.67,55 44.67,56.6 IC2.10 | IC2.32 41.67,72.3 41.67,71 36.5,65.83 C3.2 37,63 39.67,63 44.12,58.55
  Bottom 1.27: IC2.32 41.58,72.61 arc-45 42.76,74.38 43.31,74.81 43.84,75.15 44.19,75.17 46.43,73.76 IC2.30 | SRF04_2.1 78.77,38.1 79.37,38 79.34,36.39 USART.2 | SV6.2 54.25,88.27 | 54.25,88.27 54.22,88.08 54.24,86 54.31,85.07 Q9.E | R1.1 59.36,89.69 57.56,88.34 54.25,88.27 | IC2.10 44.12,58.55 | 36.67,63.33 C3.2
  Bottom 1.422: D9.C 39.05,45.73 R17.2 | SV1.2 12.22,57 5.67,57 | 5.67,57 6.02,56.65 U$1.3 6.02,53.22 8.59,50.66 8.59,49 9.37,48.21 10.67,48.21 | 5.67,57 4.67,58 4.67,59.61 SV3.2 | 18.67,48.21 10.67,48.21 | SRF04_1.1 10.56,48.1 10.67,48.21
VCC2  (via drill 0.8 pad 1.42)
  Top 0.813: v71.67,42 71.67,38.39 73.43,36.62 73.43,36.56 74.41,35.58 74.41,35.52 74.67,35.26 74.67,29 76.19,27.47 76.19,21.51
  Top 1.016: 33.67,13.77 33.67,11 v18.67,11 | 33.67,14 33.67,13.77 | 33.67,13.77 Q17.1 | 59.67,17 60.03,17.28 63.65,20.25 | 76.19,21.51 74.78,20.1
  Top 1.27: 33.67,11 33.67,10 51.67,10 53.81,13.14 Q13.1 53.81,16.14 54.67,17 59.67,17 | 63.65,20.25 74.65,20.25 74.78,20.1 76.67,18 76.67,12.25 75.11,10.68 69.99,10.68 69.09,11.58 69.09,13.79 Q14.1 | v78.49,85.17 78.67,85 75.92,85.05 75.92,77.05 78.56,75 78.56,64 80.67,62 v80.67,61
  Bottom 0.813: 79.68,91.67 64.44,91.67 | D2.C 74.64,49.77 71.72,46.51 v71.67,42
  Bottom 1.016: Q18.1 18.81,11.14 v18.67,11
  Bottom 1.27: D2.C D8.C 78.41,60.74 v80.67,61 | C5.+ 78.41,85.09 v78.49,85.17 80.95,87.63 80.95,90.17 79.68,91.67 | 64.44,91.67 61.9,88.9
  Bottom 1.778: 61.9,88.9 61.9,83.82
  Bottom 2.54: IC1.1 61.9,83.82 Q9.C

### Text on the board
Top: CE B 2016 | Workshop Sistem Analog | Mr M.Mobed Bachtiar SST MT | RAP FORCE
Bottom: Line tracer Microcontroller